# EAGLE schematic ir (EAGLE 9.5.1)
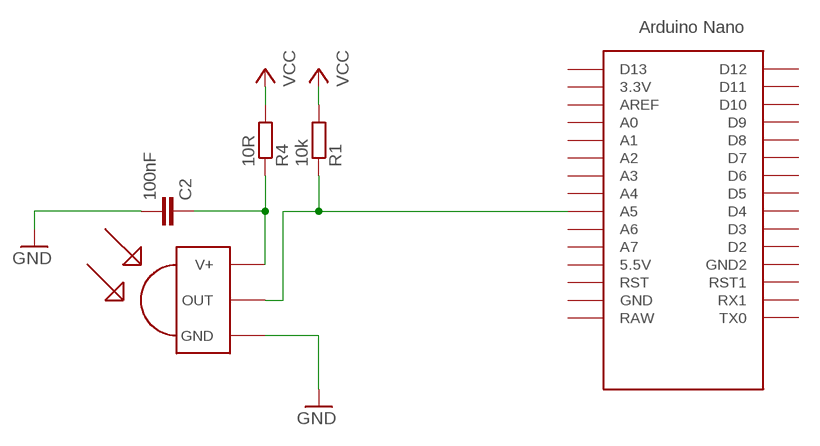
[diagram p0: schematic, sheet 1]

## Parts
C2  100nF  C-EU025-025X050  [C025-025X050]
R1  10k  R-EU_0207/10  [0207/10]
R4  10R  R-EU_0207/10  [0207/10]
U$1  TSOP4838  [TSOP18XX]
U$2  NANO  [NANO]

## Nets
GND: C2.2 U$1.GND
N$7: R1.1 U$1.OUT U$2.A5
N$10: C2.1 R4.1 U$1.VCC(V+)
VCC: R1.2 R4.2
Unconnected: U$2.3.3V U$2.5V(5.5V) U$2.A0 U$2.A1 U$2.A2 U$2.A3 U$2.A4 U$2.A6 U$2.A7 U$2.AREF U$2.D2 U$2.D3 U$2.D4 U$2.D5 U$2.D6 U$2.D7 U$2.D8 U$2.D9 U$2.D10 U$2.D11 U$2.D12 U$2.D13 U$2.GND U$2.GND1(GND2) U$2.ICSP1 U$2.ICSP2 U$2.ICSP3 U$2.ICSP4 U$2.ICSP5 U$2.ICSP6 U$2.RAW U$2.RST U$2.RST1 U$2.RX1 U$2.TX0

## Library data of the parts
C2 = rcl:C-EU: CAPACITOR, European symbol; SPICEPREFIX: C
R1 R4 = rcl:R-EU_: RESISTOR, European symbol; SPICEPREFIX: R
U$1 = tsop:TSOP4838: IR Receiver and Demodulator
U$2 = Arduino-clone:NANO: Arduino Nano